# EAGLE schematic rudder (EAGLE 6.5.0)
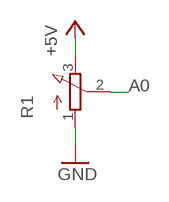
[diagram p0: schematic, sheet 1]

## Parts
R1  3RP/1610N  [3RP/1610N]

## Nets
+5V: R1.3(E)
A0: R1.2(S)
GND: R1.1(A)

## Library data of the parts
R1 = pot:3RP/1610N: 16mm Potentiometer one level Source: http://www.alphapotentiometers.net/html/16mm_pot_2.html